# EAGLE design Data-logger_v01-02 (EAGLE 9.6.2)
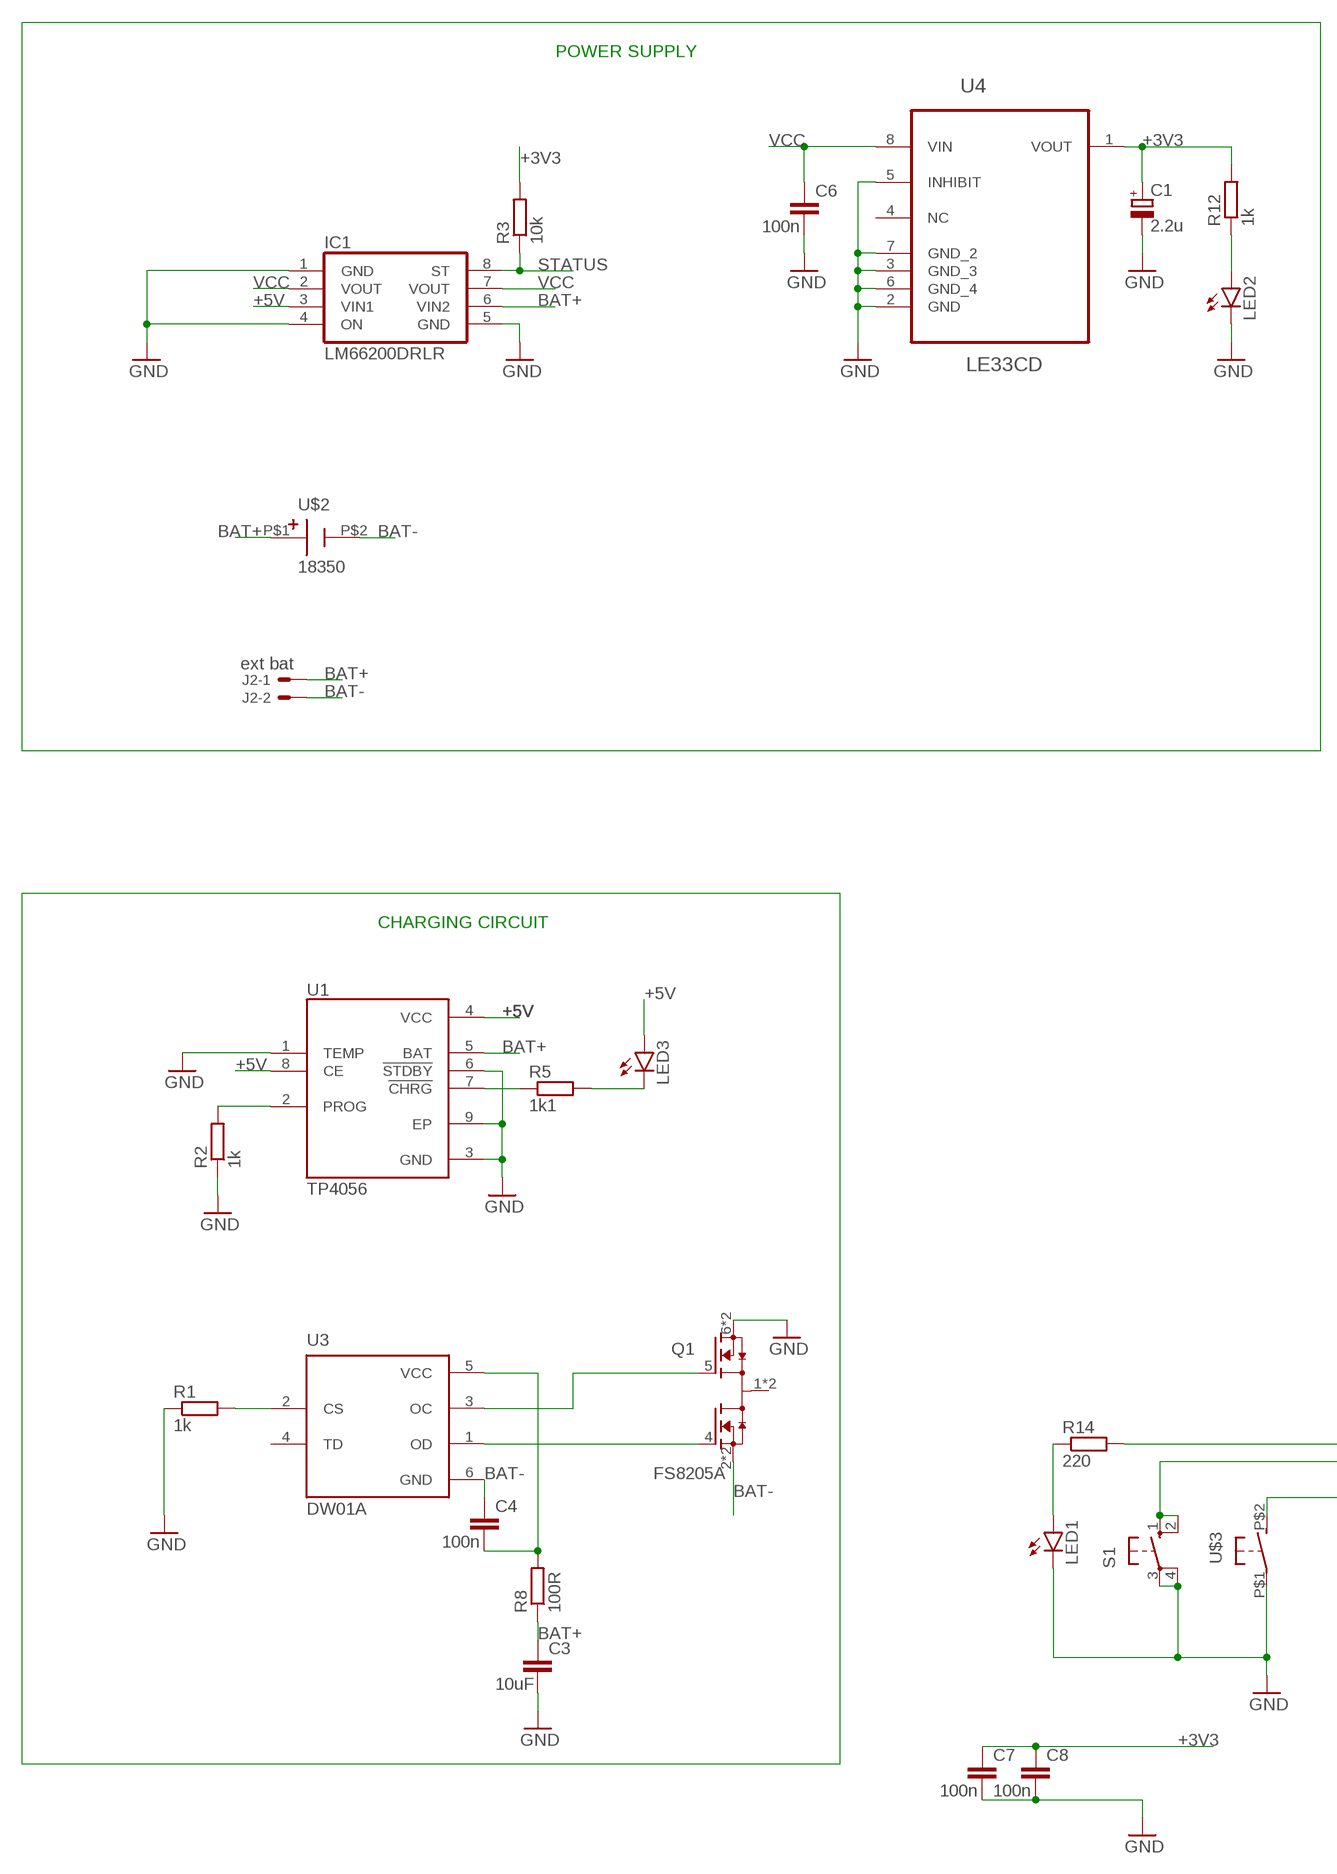
[diagram p0: schematic, sheet 1, part 1 of 2]
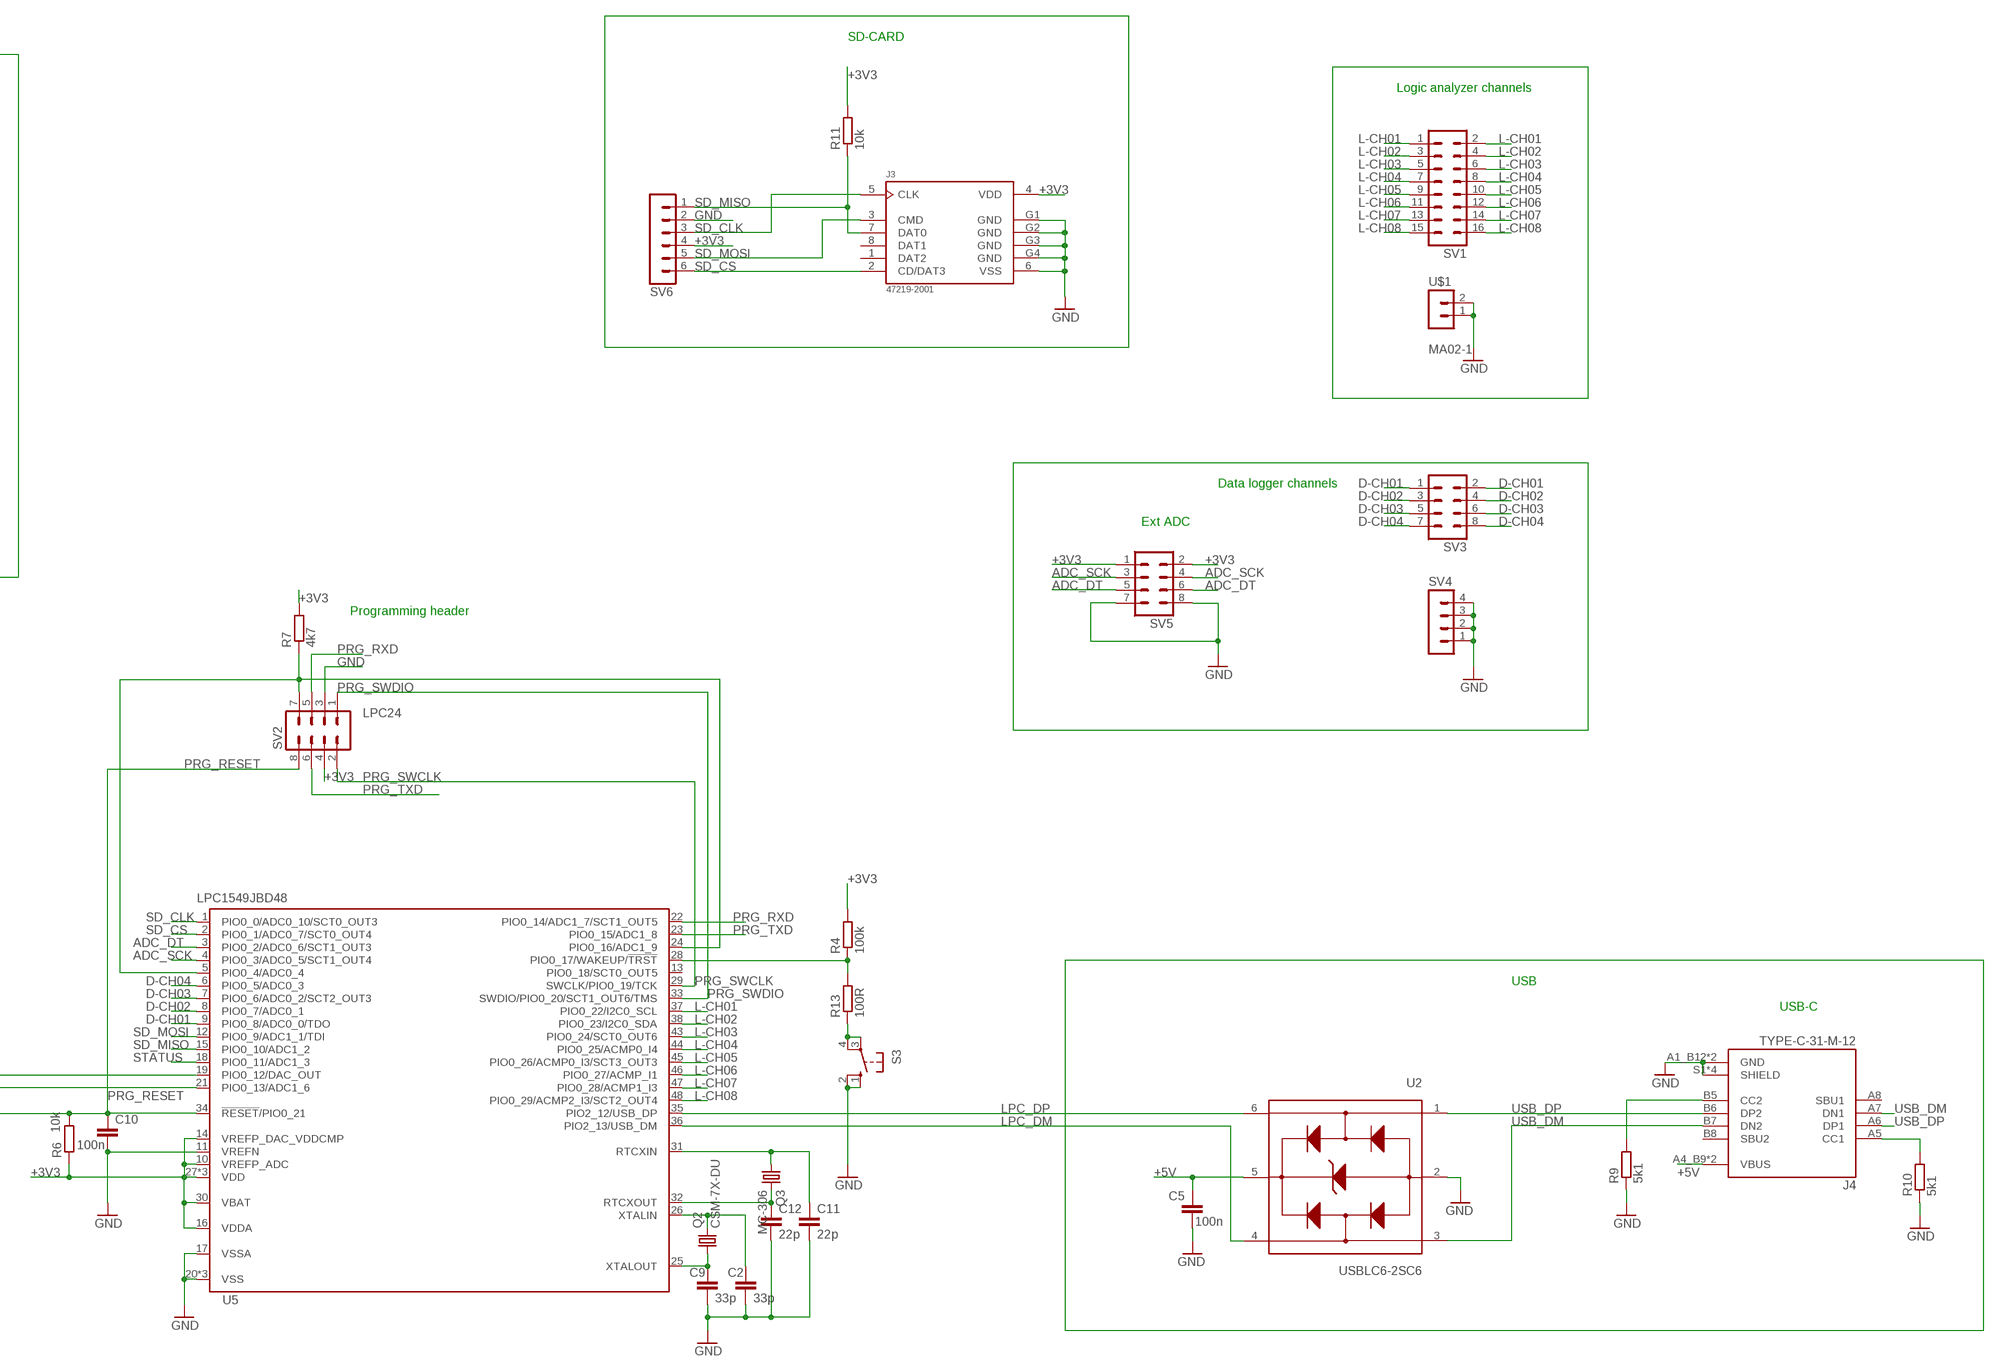
[diagram p1: schematic, sheet 1, part 2 of 2]

## Parts
C1  2.2u  CPOL-EU140CLH-0810  [140CLH-0810]
C2  33p  C-EUC0805  [C0805]
C3  10uF  C-EUC0805  [C0805]
C4  100n  C-EUC0805  [C0805]
C5  100n  C-EUC0805  [C0805]
C6  100n  C-EUC0805  [C0805]
C7  100n  C-EUC0805  [C0805]
C8  100n  C-EUC0805  [C0805]
C9  33p  C-EUC0805  [C0805]
C10  100n  C-EUC0805  [C0805]
C11  22p  C-EUC0805  [C0805]
C12  22p  C-EUC0805  [C0805]
IC1  LM66200DRLR  [SOT8]
J2  ext bat  22-05-7028-02  [7395-02]
J3  47219-2001  [MOLEX_47219-2001]
J4  TYPE-C-31-M-12  [HRO_TYPE-C-31-M-12]
LED1  LEDCHIPLED_1206  [CHIPLED_1206]
LED2  LEDCHIPLED_1206  [CHIPLED_1206]
LED3  LEDCHIPLED_1206  [CHIPLED_1206]
Q1  FS8205A  [SOP65P640X120-8N]
Q2  CSM-7X-DU  [CSM-7X-DU]
Q3  MC-306  [MC-306]
R1  1k  R-EU_R0805  [R0805]
R2  1k  R-EU_R0805  [R0805]
R3  10k  R-EU_R0805  [R0805]
R4  100k  R-EU_R0805  [R0805]
R5  1k1  R-EU_R0805  [R0805]
R6  10k  R-EU_R0805  [R0805]
R7  4k7  R-EU_R0805  [R0805]
R8  100R  R-EU_R0805  [R0805]
R9  5k1  R-EU_R0805  [R0805]
R10  5k1  R-EU_R0805  [R0805]
R11  10k  R-EU_R0805  [R0805]
R12  1k  R-EU_R0805  [R0805]
R13  100R  R-EU_R0805  [R0805]
R14  220  R-EU_R0805  [R0805]
S1  10-XX  [B3F-10XX]
S3  10-XX  [B3F-10XX]
SV1  MA08-2  [MA08-2]
SV2  MA04-2  [MA04-2]
SV3  MA04-2  [MA04-2]
SV4  MA04-1  [MA04-1]
SV5  MA04-2  [MA04-2]
SV6  MA06-1  [MA06-1]
U1  TP4056  [SOP127P600X175-9N]
U2  USBLC6-2SC6  [SOT95P280X145-6N]
U3  DW01A  [SOT95P280X145-6N]
U4  LE33CD  [SOIC127P600X175-8N]
U5  LPC1549JBD48  [SOT313-2]
U$1  MA02-1  [MA02-1]
U$2  18350  [18350]
U$3  BUTTON_SMD_MINI  [PTS636SP43SMTRLFS]

## Nets
+3V3: C1.+ C7.1 C8.1 J3.4(VDD) R3.2 R4.2 R6.1 R7.2 R11.2 R12.2 SV2.4 SV5.1 SV5.2 SV6.4 U4.1(VOUT) U5.10(VREFP_ADC) U5.14(VREFP_DAC_VDDCMP) U5.16(VDDA) U5.27(VDD) U5.30(VBAT) U5.39(VDD) U5.42(VDD)
+5V: C5.1 IC1.3(VIN1) J4.A4_B9(VBUS) J4.B4_A9(VBUS) LED3.A U1.4(VCC) U1.8(CE) U2.5(VBUS)
ADC_DT: SV5.5 SV5.6 U5.3(PIO0_2/ADC0_6/SCT1_OUT3)
ADC_SCK: SV5.3 SV5.4 U5.4(PIO0_3/ADC0_5/SCT1_OUT4)
BAT+: C3.1 IC1.6(VIN2) J2.1 R8.1 U1.5(BAT) U$2.P$1(+)
BAT-: C4.1 J2.2 Q1.2(S1) Q1.3(S1) U3.6(GND) U$2.P$2(-)
D-CH01: SV3.1 SV3.2 U5.9(PIO0_8/ADC0_0/TDO)
D-CH02: SV3.3 SV3.4 U5.8(PIO0_7/ADC0_1)
D-CH03: SV3.5 SV3.6 U5.7(PIO0_6/ADC0_2/SCT2_OUT3)
D-CH04: SV3.7 SV3.8 U5.6(PIO0_5/ADC0_3)
GND: C1.- C2.2 C3.2 C5.2 C6.2 C7.2 C8.2 C9.2 C10.2 C11.2 C12.2 IC1.1(GND) IC1.4(ON) IC1.5(GND) J3.6(VSS) J3.G1(GND) J3.G2(GND) J3.G3(GND) J3.G4(GND) J4.A1_B12(GND) J4.B1_A12(GND) J4.S1(SHIELD) J4.S2(SHIELD) J4.S3(SHIELD) J4.S4(SHIELD) LED1.C LED2.C Q1.6(S2) Q1.7(S2) R1.1 R2.1 R9.1 R10.1 S1.3(P) S1.4(P1) S3.1(S) S3.2(S1) SV2.3 SV4.1 SV4.2 SV4.3 SV4.4 SV5.7 SV5.8 SV6.2 U1.1(TEMP) U1.3(GND) U1.6(!STDBY) U1.9(EP) U2.2(GND) U4.2(GND) U4.3(GND_3) U4.5(INHIBIT) U4.6(GND_4) U4.7(GND_2) U5.11(VREFN) U5.17(VSSA) U5.20(VSS) U5.40(VSS) U5.41(VSS) U$1.1 U$1.2 U$3.P$1(P)
L-CH01: SV1.1 SV1.2 U5.37(PIO0_22/I2C0_SCL)
L-CH02: SV1.3 SV1.4 U5.38(PIO0_23/I2C0_SDA)
L-CH03: SV1.5 SV1.6 U5.43(PIO0_24/SCT0_OUT6)
L-CH04: SV1.7 SV1.8 U5.44(PIO0_25/ACMP0_I4)
L-CH05: SV1.9 SV1.10 U5.45(PIO0_26/ACMP0_I3/SCT3_OUT3)
L-CH06: SV1.11 SV1.12 U5.46(PIO0_27/ACMP_I1)
L-CH07: SV1.13 SV1.14 U5.47(PIO0_28/ACMP1_I3)
L-CH08: SV1.15 SV1.16 U5.48(PIO0_29/ACMP2_I3/SCT2_OUT4)
LPC24: R7.1 SV2.7 U5.5(PIO0_4/ADC0_4) U5.24(PIO0_16/ADC1_9)
LPC25: C9.1 Q2.1 U5.25(XTALOUT)
LPC26: C2.1 Q2.2 U5.26(XTALIN)
LPC31: C11.1 Q3.1 U5.31(RTCXIN)
LPC32: C12.1 Q3.4 U5.32(RTCXOUT)
LPC_DM: U2.4(I/O2_OUT) U5.36(PIO2_13/USB_DM)
LPC_DP: U2.6(I/O1_OUT) U5.35(PIO2_12/USB_DP)
N$1: R2.2 U1.2(PROG)
N$2: C4.2 R8.2 U3.5(VCC)
N$3: R1.2 U3.2(CS)
N$4: Q1.4(G1) U3.1(OD)
N$5: Q1.5(G2) U3.3(OC)
N$6: R5.1 U1.7(!CHRG)
N$7: J4.A5(CC1) R10.2
N$8: LED3.C R5.2
N$13: R4.1 R13.2 U5.28(PIO0_17/WAKEUP/!TRST)
N$14: R13.1 S3.3(P) S3.4(P1)
N$15: J4.B5(CC2) R9.2
N$16: S1.1(S) S1.2(S1) U5.21(PIO0_13/ADC1_6)
N$19: LED2.A R12.1
N$20: LED1.A R14.1
N$21: R14.2 U5.19(PIO0_12/DAC_OUT)
PRG_RESET: C10.1 R6.2 SV2.8 U5.34(!RESET!/PIO0_21) U$3.P$2(S)
PRG_RXD: SV2.5 U5.22(PIO0_14/ADC1_7/SCT1_OUT5)
PRG_SWCLK: SV2.2 U5.29(SWCLK/PIO0_19/TCK)
PRG_SWDIO: SV2.1 U5.33(SWDIO/PIO0_20/SCT1_OUT6/TMS)
PRG_TXD: SV2.6 U5.23(PIO0_15/ADC1_8)
SD_CLK: J3.5(CLK) SV6.3 U5.1(PIO0_0/ADC0_10/SCT0_OUT3)
SD_CS: J3.2(CD/DAT3) SV6.6 U5.2(PIO0_1/ADC0_7/SCT0_OUT4)
SD_MISO: J3.7(DAT0) R11.1 SV6.1 U5.15(PIO0_10/ADC1_2)
SD_MOSI: J3.3(CMD) SV6.5 U5.12(PIO0_9/ADC1_1/TDI)
STATUS: IC1.8(ST) R3.1 U5.18(PIO0_11/ADC1_3)
USB_DM: J4.A7(DN1) J4.B7(DN2) U2.3(I/O2_IN)
USB_DP: J4.A6(DP1) J4.B6(DP2) U2.1(I/O1_IN)
VCC: C6.1 IC1.2(VOUT) IC1.7(VOUT) U4.8(VIN)
Unconnected: J3.1(DAT2) J3.8(DAT1) J4.A8(SBU1) J4.B8(SBU2) Q1.1(D12) Q1.8(D12) U3.4(TD) U4.4(NC) U5.13(PIO0_18/SCT0_OUT5)

## Notes on the sheet
- SD-CARD
- POWER SUPPLY
- Logic analyzer channels
- Data logger channels
- Ext ADC
- Programming header
- CHARGING CIRCUIT
- USB
- USB-C

## Library data of the parts
C1 = rcl:CPOL-EU: POLARIZED CAPACITOR, European symbol; SPICEPREFIX: C
C2-C12 = rcl:C-EU: CAPACITOR, European symbol; SPICEPREFIX: C
IC1 = LM66200DRLR:LM66200DRLR: Check availability <https://pricing.snapeda.com/parts/LM66200DRLR/Texas%20Instruments/view-part?ref=eda>; AVAILABILITY: In Stock; CHECK_PRICES: https://www.snapeda.com/parts/LM66200DRLR/Texas+Instruments/view-part/?ref=eda; DESCRIPTION: 1.6-V to 5.5-V, 40-mΩ, 2.5-A, low-IQ, dual ideal diode; MF: Texas Instruments; MP: LM66200DRLR; PACKAGE: None; PRICE: None; SNAPEDA_LINK: https://www.snapeda.com/parts/LM66200DRLR/Texas+Instruments/view-part/?ref=snap
J2 = con-molex:22-?-02: CONNECTOR wire to board 2.54 mm (.1 inch) pitch header; MF: MOLEX; OC_FARNELL: 9731601; OC_NEWARK: unknown
J3 = micro-sd-47219-2001:47219-2001: Check availability <https://pricing.snapeda.com/parts/472192001/Molex/view-part?ref=eda>; AVAILABILITY: In Stock; CHECK_PRICES: https://www.snapeda.com/parts/472192001/Molex/view-part/?ref=eda; DESCRIPTION: 8 Position Card Connector Secure Digital - microSD™ Surface Mount, Right Angle Gold; MF: Molex; MP: 472192001; PACKAGE: None; PRICE: None; SNAPEDA_LINK: https://www.snapeda.com/parts/472192001/Molex/view-part/?ref=snap
J4 = TYPE-C-31-M-12:TYPE-C-31-M-12: Check availability <https://pricing.snapeda.com/parts/TYPE-C-31-M-12/HRO%20Electronics%20Co.%2C%20Ltd./view-part?ref=eda>; AVAILABILITY: Not in stock; CHECK_PRICES: https://www.snapeda.com/parts/TYPE-C-31-M-12/HRO+Electronics+Co.%252C+Ltd./view-part/?ref=eda; DESCRIPTION: USB Connectors 24 Receptacle 1 8.94*7.3mm RoHS; MF: HRO Electronics Co., Ltd.; MP: TYPE-C-31-M-12; PACKAGE: Package; PRICE: None; SNAPEDA_LINK: https://www.snapeda.com/parts/TYPE-C-31-M-12/HRO+Electronics+Co.%252C+Ltd./view-part/?ref=snap
LED1-LED3 = led:LED: LED OSRAM: - CHIPLED LG R971, LG N971, LY N971, LG Q971, LY Q971, LO R971, LY R971 LH N974, LH R974 LS Q976, LO Q976, LY Q976 LO Q996 - Hyper CHIPLED LW Q18S LB Q993, LB Q99A, LB R99A - SideLED LS A670, LO A670, LY A670, LG A670, LP A670 LB A673, LV A673, LT A673, LW A673 LH A674 LY A675 LS A676, LA A676, LO A676, LY A676, LW A676 LS A679, LY A679, LG A679 - Hyper Micro SIDELED® LS Y876, LA Y876, LO Y876, LY Y876 LT Y87S - SmartLED LW L88C, LW L88S LB L89C, LB L89S, LG L890 LS L89K, LO L89K, LY L89K LS L896, LA L896, LO L896, LY L896 - TOPLED LS T670, LO T670, LY T670, LG T670, LP T670 LSG T670, LSP T670, LSY T670, LOP T670, LYG T670 LG T671, LOG T671, LSG T671 LB T673, LV T673, LT T673, LW T673 LH T674 LS T676, LA T676, LO T676, LY T676, LB T676, LH T676, LSB T676, LW T676 LB T67C, LV T67C, LT T67C, LS T67K, LO T67K, LY T67K, LW E67C LS E67B, LA E67B, LO E67B, LY E67B, LB E67C, LV E67C, LT E67C LW T67C LS T679, LY T679, LG T679 LS T770, LO T770, LY T770, LG T770, LP T770 LB T773, LV T773, LT T773, LW T773 LH T774 LS E675, LA E675, LY E675, LS T675 LS T776, LA T776, LO T776, LY T776, LB T776 LHGB T686 LT T68C, LB T68C - Hyper Mini TOPLED® LB M676 - Mini TOPLED Santana® LG M470 LS M47K, LO M47K, LY M47K Source: http://www.osram.convergy.de LUXEON: - LUMILED® LXK2-PW12-R00, LXK2-PW12-S00, LXK2-PW14-U00, LXK2-PW14-V00 LXK2-PM12-R00, LXK2-PM12-S00, LXK2-PM14-U00 LXK2-PE12-Q00, LXK2-PE12-R00, LXK2-PE12-S00, LXK2-PE14-T00, LXK2-PE14-U00 LXK2-PB12-K00, LXK2-PB12-L00, LXK2-PB12-M00, LXK2-PB14-N00, LXK2-PB14-P00, LXK2-PB14-Q00 LXK2-PR12-L00, LXK2-PR12-M00, LXK2-PR14-Q00, LXK2-PR14-R00 LXK2-PD12-Q00, LXK2-PD12-R00, LXK2-PD12-S00 LXK2-PH12-R00, LXK2-PH12-S00 LXK2-PL12-P00, LXK2-PL12-Q00, LXK2-PL12-R00 Source: www.luxeon.com KINGBRIGHT: KA-3528ASYC Source: www.kingbright.com
Q1 = FS8205A_TSSOP-8:FS8205A: Check availability <https://pricing.snapeda.com/parts/FS8205A/Fortune%20Semiconductor/view-part?ref=eda>; AVAILABILITY: In Stock; CHECK_PRICES: https://www.snapeda.com/parts/FS8205A/Fortune+Semiconductor/view-part/?ref=eda; MF: Fortune Semiconductor; MP: FS8205A; PACKAGE: Package; PRICE: None; SNAPEDA_LINK: https://www.snapeda.com/parts/FS8205A/Fortune+Semiconductor/view-part/?ref=snap
Q2 = crystal:CSM-7X-DU: SMD CRYSTAL Source: www.ecsxtal.com .. Crystal 3.6864MHz CSM_7X_DU.PDF; OC_FARNELL: unknown; OC_NEWARK: unknown
Q3 = crystal:MC-306: kHz RANGE CRYSTAL UNIT SMD Source: MC-306_405_406_E07X.PDF Homepage <http://www.epsontoyocom.co.jp>; MPN: MC-306 60.0KHZ 100PPM ,12.5PF; OC_FARNELL: 1278040; OC_NEWARK: 31M5576
R1-R14 = rcl:R-EU_: RESISTOR, European symbol; SPICEPREFIX: R
S1 S3 = switch-omron:10-XX: OMRON SWITCH; MPN: B3F-1000; OC_FARNELL: 176432; OC_NEWARK: 36M3542
SV1 = 6x2-pin-header-2_54:MA08-2: PIN HEADER; OC_FARNELL: unknown; OC_NEWARK: unknown
SV2 SV3 SV5 = 6x2-pin-header-2_54:MA04-2: PIN HEADER; OC_FARNELL: unknown; OC_NEWARK: unknown
SV4 = 6x2-pin-header-2_54:MA04-1: PIN HEADER; OC_FARNELL: unknown; OC_NEWARK: unknown
SV6 = 6x2-pin-header-2_54:MA06-1: PIN HEADER; OC_FARNELL: unknown; OC_NEWARK: unknown
U1 = TP4056_SOP-8:TP4056: Check availability <https://pricing.snapeda.com/parts/TP4056/NanJing%20Top%20Power%20ASIC%20Corp./view-part?ref=eda>; AVAILABILITY: Not in stock; CHECK_PRICES: https://www.snapeda.com/parts/TP4056/NanJing+Top+Power+ASIC+Corp./view-part/?ref=eda; DESCRIPTION: Complete single cell Li-Ion battery with a constant current / constant voltage linear charger; MF: NanJing Top Power ASIC Corp.; MP: TP4056; PACKAGE: Package; PRICE: None; SNAPEDA_LINK: https://www.snapeda.com/parts/TP4056/NanJing+Top+Power+ASIC+Corp./view-part/?ref=snap
U2 = USBLC6-2SC6:USBLC6-2SC6: Check availability <https://pricing.snapeda.com/parts/USBLC6-2SC6/STMicroelectronics/view-part?ref=eda>; AVAILABILITY: In Stock; CHECK_PRICES: https://www.snapeda.com/parts/USBLC6-2SC6/STMicroelectronics/view-part/?ref=eda; DESCRIPTION: 17V Clamp 5A (8/20µs) Ipp Tvs Diode Surface Mount SOT-23-6; MF: STMicroelectronics; MP: USBLC6-2SC6; PACKAGE: SOT-23-6 STMicroelectronics; PRICE: None; SNAPEDA_LINK: https://www.snapeda.com/parts/USBLC6-2SC6/STMicroelectronics/view-part/?ref=snap
U3 = DW01A_SOT-23-6:DW01A: Check availability <https://pricing.snapeda.com/parts/DW01A/Fortune%20Semiconductor/view-part?ref=eda>; AVAILABILITY: Not in stock; CHECK_PRICES: https://www.snapeda.com/parts/DW01A/Fortune+Semiconductor/view-part/?ref=eda; DESCRIPTION: One Cell Lithium-ion/Polymer Battery Protection IC; MF: Fortune Semiconductor; MP: DW01A; PACKAGE: SOT-23-6 Fortune Semiconductor; PRICE: None; SNAPEDA_LINK: https://www.snapeda.com/parts/DW01A/Fortune+Semiconductor/view-part/?ref=snap
U4 = LE33CD_SOIC-8:LE33CD: Check availability <https://pricing.snapeda.com/parts/LE33CD/STMicroelectronics/view-part?ref=eda>; AVAILABILITY: In Stock; CHECK_PRICES: https://www.snapeda.com/parts/LE33CD/STMicroelectronics/view-part/?ref=eda; DESCRIPTION: Linear Voltage Regulator IC Positive Fixed 1 Output 100mA 8-SOIC; MF: STMicroelectronics; MP: LE33CD; PACKAGE: SOIC-8 STMicroelectronics; PRICE: None; SNAPEDA_LINK: https://www.snapeda.com/parts/LE33CD/STMicroelectronics/view-part/?ref=snap
U5 = LPC1549JBD48:LPC1549JBD48: Check availability <https://pricing.snapeda.com/parts/LPC1549JBD48/NXP%20Semiconductors/view-part?ref=eda>; AVAILABILITY: In Stock; CHECK_PRICES: https://www.snapeda.com/parts/LPC1549JBD48/NXP+Semiconductors/view-part/?ref=eda; DESCRIPTION: ARM® Cortex®-M3 LPC15xx Microcontroller IC 32-Bit 72MHz 256KB (256K x 8) FLASH 48-LQFP (7x7); MF: NXP Semiconductors; MP: LPC1549JBD48; PACKAGE: QFP-48 NXP; PRICE: None; SNAPEDA_LINK: https://www.snapeda.com/parts/LPC1549JBD48/NXP+Semiconductors/view-part/?ref=snap
U$1 = 6x2-pin-header-2_54:MA02-1
U$2 = BH-18650-PC:18350
U$3 = PTS636SP43SMTRLFS_button:BUTTON_SMD_MINI

## Board
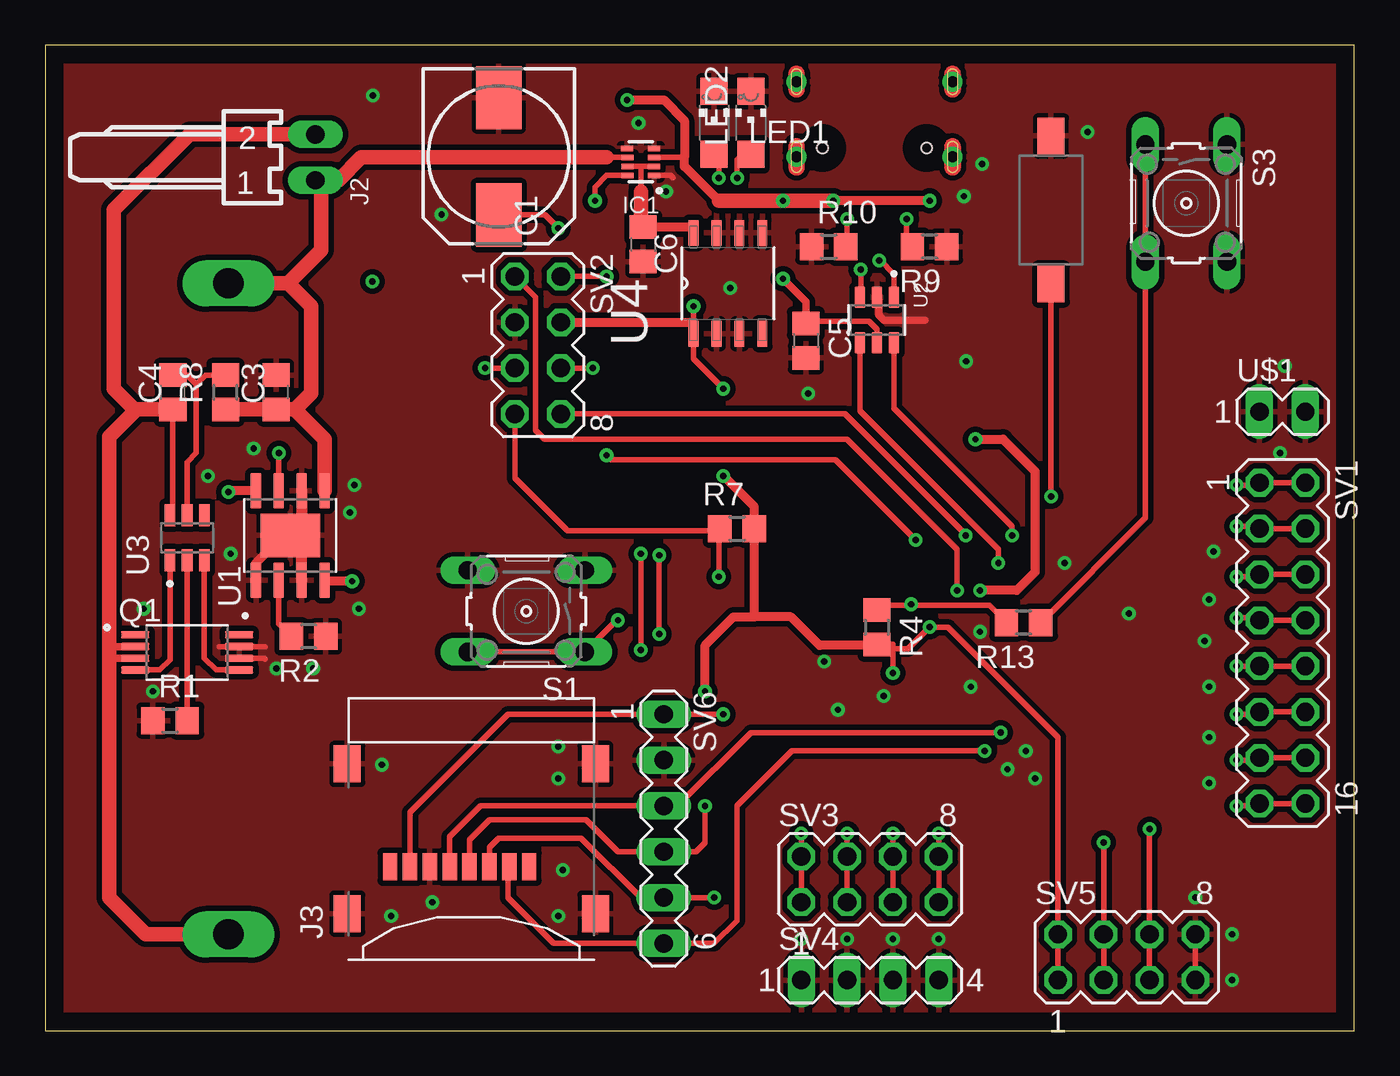
[diagram p2: board, top side]
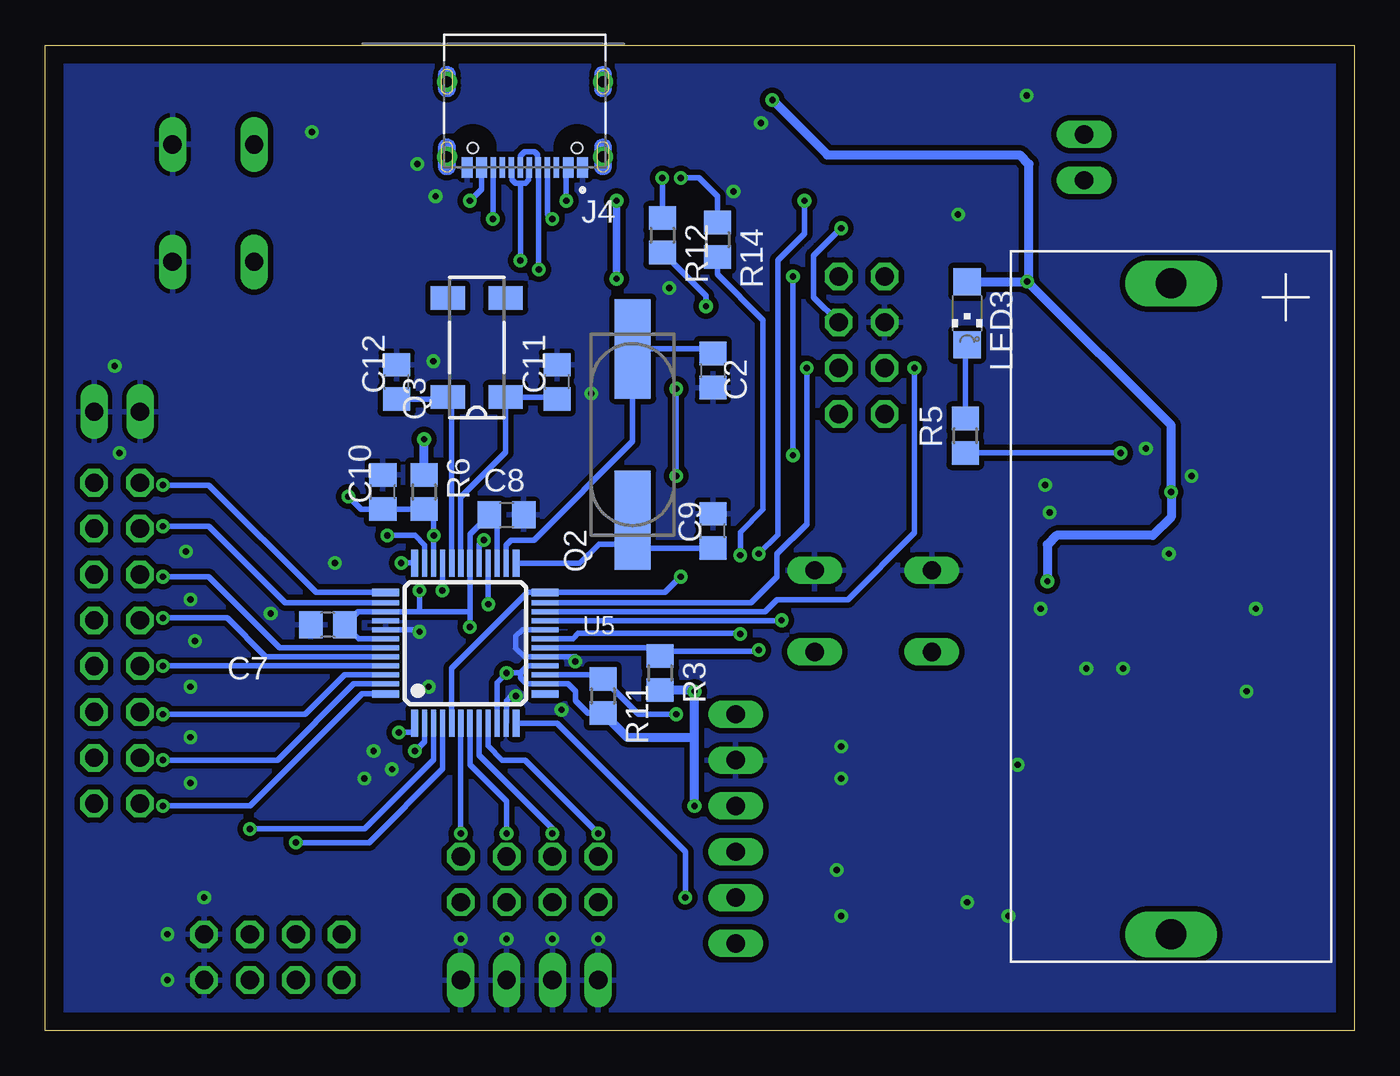
[diagram p3: board, bottom side, seen from below]

Size 72.57 x 54.6 mm. Coordinates in mm from the lower left corner, seen from the top.
Outline: 0,0 72.57,0 72.57,54.6 0,54.6 0,0
Copper layers (1*16): Top 0.035mm / dielectric 1.5mm / Bottom 0.035mm
Design rules "default": minimum track width 6mil, minimum drill 0.35mm, track to track 6mil, track to pad 6mil, pad to pad 6mil, via to via 6mil, smd to smd 6mil, copper to edge 40mil, drill to drill 6mil, minimum pad ring 10mil, minimum via ring 8mil, stop-mask expansion 4mil, vias tented up to drill 0mil, thermal gap 10mil

### Footprints (pad centres in the part's own frame; a part is rotated, then mirrored left to right if it is on the bottom)
140CLH-0810 = smd 3.5 x 2.5: + 3.25,0; - -3.25,0
C0805 = smd 1.3 x 1.5: 1 -0.95,0; 2 0.95,0
SOT8 = smd 0.3 x 0.67: 1 -0.75,-0.74; 2 -0.25,-0.74; 3 0.25,-0.74; 4 0.75,-0.74; 5 0.75,0.76; 6 0.25,0.74; 7 -0.25,0.74; 8 -0.75,0.74
7395-02 = drill 1.016 long: 1 1.27,0; 2 -1.27,0
MOLEX_47219-2001 = smd 0.8 x 1.5: 1 3.2,-2.1; 2 2.1,-2.1; 3 1,-2.1; 4 -0.1,-2.1; 5 -1.2,-2.1; 6 -2.3,-2.1; 7 -3.4,-2.1; 8 -4.5,-2.1 | smd 1.5 x 2.05: G1 6.875,-4.7; G2 6.875,3.6; G3 -6.875,3.6; G4 -6.875,-4.7
HRO_TYPE-C-31-M-12 = smd 0.6 x 1.14: A1_B12 -3.2,4.75; A4_B9 -2.4,4.75; B1_A12 3.2,4.75; B4_A9 2.4,4.75 | smd 0.3 x 1.14: A5 -1.25,4.75; A6 -0.25,4.75; A7 0.25,4.75; A8 1.25,4.75; B5 1.75,4.75; B6 0.75,4.75; B7 -0.75,4.75; B8 -1.75,4.75 | drill 0.6 pad 0.9: S1 -4.325,4.17; S2 4.325,4.17; S3 -4.325,0; S4 4.325,0 | hole 0.6: -2.89,3.68; 2.89,3.68
CHIPLED_1206 = smd 1.5 x 1.5: A 0,-1.75; C 0,1.75
SOP65P640X120-8N = smd 1.56 x 0.4: 1 -2.88,0.975; 2 -2.88,0.325; 3 -2.88,-0.325; 4 -2.88,-0.975; 5 2.88,-0.975; 6 2.88,-0.325; 7 2.88,0.325; 8 2.88,0.975
CSM-7X-DU = smd 5.5 x 2: 1 -4.75,0; 2 4.75,0
MC-306 = smd 1.3 x 1.9: 1 -2.75,-1.6; 2 2.75,-1.6; 3 2.75,1.6; 4 -2.75,1.6
R0805 = smd 1.3 x 1.5: 1 -0.95,0; 2 0.95,0
B3F-10XX = drill 1.016 long: 1 -3.251,2.261; 2 3.251,2.261; 3 -3.251,-2.261; 4 3.251,-2.261
MA08-2 = drill 1.016 octagon: 1 -8.89,-1.27; 2 -8.89,1.27; 3 -6.35,-1.27; 4 -6.35,1.27; 5 -3.81,-1.27; 6 -3.81,1.27; 7 -1.27,-1.27; 8 -1.27,1.27; 9 1.27,-1.27; 10 1.27,1.27; 11 3.81,-1.27; 12 3.81,1.27; 13 6.35,-1.27; 14 6.35,1.27; 15 8.89,-1.27; 16 8.89,1.27
MA04-2 = drill 1.016 octagon: 1 -3.81,-1.27; 2 -3.81,1.27; 3 -1.27,-1.27; 4 -1.27,1.27; 5 1.27,-1.27; 6 1.27,1.27; 7 3.81,-1.27; 8 3.81,1.27
MA04-1 = drill 1.016 long: 1 -3.81,0; 2 -1.27,0; 3 1.27,0; 4 3.81,0
MA06-1 = drill 1.016 long: 1 -6.35,0; 2 -3.81,0; 3 -1.27,0; 4 1.27,0; 5 3.81,0; 6 6.35,0
SOP127P600X175-9N = smd 1.97 x 0.6: 1 -2.475,1.905; 2 -2.475,0.635; 3 -2.475,-0.635; 4 -2.475,-1.905; 5 2.475,-1.905; 6 2.475,-0.635; 7 2.475,0.635; 8 2.475,1.905 | smd 2.413 x 3.302: 9 0,0
SOT95P280X145-6N = smd 1.21 x 0.59: 1 -1.255,0.95; 2 -1.255,0; 3 -1.255,-0.95; 4 1.255,-0.95; 5 1.255,0; 6 1.255,0.95
SOIC127P600X175-8N = smd 1.422 x 0.533: 1 -2.794,1.905; 2 -2.794,0.635; 3 -2.794,-0.635; 4 -2.794,-1.905; 5 2.794,-1.905; 6 2.794,-0.635; 7 2.794,0.635; 8 2.794,1.905
SOT313-2 = smd 0.4 x 1.5: 1 -2.81,-4.425; 12 2.81,-4.425; 25 2.81,4.425; 36 -2.81,4.425 | smd 0.28 x 1.5: 2 -2.25,-4.425; 3 -1.75,-4.425; 4 -1.25,-4.425; 5 -0.75,-4.425; 6 -0.25,-4.425; 7 0.25,-4.425; 8 0.75,-4.425; 9 1.25,-4.425; 10 1.75,-4.425; 11 2.25,-4.425; 26 2.25,4.425; 27 1.75,4.425; 28 1.25,4.425; 29 0.75,4.425; 30 0.25,4.425; 31 -0.25,4.425; 32 -0.75,4.425; 33 -1.25,4.425; 34 -1.75,4.425; 35 -2.25,4.425 | smd 1.5 x 0.4: 13 4.425,-2.81; 24 4.425,2.81; 37 -4.425,2.81; 48 -4.425,-2.81 | smd 1.5 x 0.28: 14 4.425,-2.25; 15 4.425,-1.75; 16 4.425,-1.25; 17 4.425,-0.75; 18 4.425,-0.25; 19 4.425,0.25; 20 4.425,0.75; 21 4.425,1.25; 22 4.425,1.75; 23 4.425,2.25; 38 -4.425,2.25; 39 -4.425,1.75; 40 -4.425,1.25; 41 -4.425,0.75; 42 -4.425,0.25; 43 -4.425,-0.25; 44 -4.425,-0.75; 45 -4.425,-1.25; 46 -4.425,-1.75; 47 -4.425,-2.25
MA02-1 = drill 1.016 long: 1 -1.27,0; 2 1.27,0
18350 = drill 1.676 pad 2.54 long: P$1 -17.272,0; P$2 18.796,0
PTS636SP43SMTRLFS = smd 2 x 1.5: P$1 -4.1,0; P$2 4.1,0

### Placement (x,y rotation side)
C1  25.15,48.44 270 top
C2  35.56,36.58 270 bottom
C3  12.8,35.37 90 top
C4  7.08,35.37 90 top
C5  42.16,38.23 270 top
C6  33.15,43.56 270 top
C7  56.9,22.48 180 bottom
C8  46.99,28.57 0 bottom
C9  35.56,27.69 90 bottom
C10  53.85,29.84 90 bottom
C11  44.2,35.94 90 bottom
C12  53.09,35.94 90 bottom
IC1  33.02,48.13 90 top
J2  14.99,48.39 270 top
J3  23.62,11.18 0 top
J4  45.97,52.58 180 bottom
LED1  37.08,50.29 0 top
LED2  39.12,50.29 0 top
LED3  21.46,39.75 180 bottom
Q1  7.87,20.95 0 top
Q2  40.01,33.02 90 bottom
Q3  48.64,37.85 90 bottom
R1  6.92,17.17 0 top
R2  14.61,21.84 180 top
R3  38.48,19.81 270 bottom
R4  46.1,22.35 270 top
R5  21.56,32.96 90 bottom
R6  51.56,29.84 270 bottom
R7  38.35,27.81 0 top
R8  10.01,35.37 90 top
R9  49.02,43.43 180 top
R10  43.43,43.43 0 top
R11  41.66,18.54 270 bottom
R12  38.35,44.07 270 bottom
R13  54.23,22.61 180 top
R14  35.31,43.81 270 bottom
S1  26.67,23.24 180 top
S3  63.25,45.85 270 top
SV1  68.58,21.46 270 top
SV2  27.3,37.97 270 top
SV3  45.72,8.38 0 top
SV4  45.72,2.79 0 top
SV5  59.94,4.06 0 top
SV6  34.29,11.18 270 top
U1  13.59,27.43 90 top
U2  46.1,39.37 270 top
U3  7.87,27.3 90 top
U4  37.85,41.4 90 top
U5  49.28,21.46 0 bottom
U$1  68.58,34.29 0 top
U$2  10.16,24.13 270 bottom
U$3  55.75,45.47 270 top

### Tracks (layer width: path | path; a pad name or v marks a point on that pad's centre or on a via)
+3V3  (via drill 0.35, 0.35 pad 0.7)
  Top 0.305: J3.4 23.52,10.57 24.64,11.68 29.97,11.68 31.75,9.91 SV6.4 36.07,9.91 36.58,10.41 v36.58,12.45 | SV5.1 SV5.2 56.13,16.26 50.04,22.35 v49.02,22.35 47.82,21.15 46.99,21.15 | v46.99,19.81 46.99,21.15 | 46.99,21.15 46.99,21.4 R4.2 46.03,21.34 | 35.94,39.12 U4.1 | U4.1 35.94,37.21 v37.59,35.56 | U4.1 v35.94,40.13 | C1.+ 27.71,45.19 v28.45,44.45
  Top 0.508: SV2.4 35.81,39.24 35.94,39.12 | v51.56,32.77 53.09,32.77 54.86,30.99 54.86,25.4 53.85,24.38 v51.82,24.38 | 46.03,21.34 42.93,21.34 41.34,22.93 39.3,22.93 | v36.58,18.8 36.58,21.34 38.17,22.93 39.3,22.93 | 39.3,22.93 R7.2 39.3,29.02 v37.59,30.73
  Bottom 0.305: U5.27 47.53,28.16 C8.1 49.03,27.49 U5.30 49.03,23.24 | 49.03,23.24 v49.03,22.36 v49.02,22.35 | R11.2 42.48,17.59 43.18,18.29 43.18,18.8 43.6,19.21 U5.14 45.88,19.21 46.23,19.56 46.23,19.81 | U5.16 45.83,20.21 46.23,19.81 | 46.23,19.81 v46.99,19.81 47.53,19.28 U5.10 | U5.42 55.18,21.71 C7.1 55.21,23.21 U5.39 51.82,23.21 | 49.03,23.24 49.05,23.21 51.82,23.21 | SV2.4 29.97,40.64 29.97,42.93 v28.45,44.45 | R12.2 35.94,40.71 v35.94,40.13 | v51.82,24.38 51.82,23.21 | v37.59,35.56 v37.59,30.73
  Bottom 0.508: v36.58,18.8 36.64,18.86 | 36.64,18.86 36.58,18.86 36.58,16.26 | 36.64,18.86 R3.2 | v36.58,12.45 36.58,16.26 | R6.1 v51.56,32.77 | R11.2 40.32,16.26 36.58,16.26
+5V  (via drill 0.35)
  Top 0.305: U2.5 46.1,38.86 45.65,39.31 42.2,39.31 C5.1 | 10.16,29.91 v10.16,29.84 | 15.56,24.89 U1.4 | IC1.3 35.44,48.38
  Top 0.406: C5.1 42.16,40.39 v40.89,41.66
  Top 0.508: U1.8 10.16,29.91 | v17.02,24.89 15.56,24.89 | v32.26,51.56 34.29,51.56 35.44,50.41 35.44,48.38 35.44,47.88 37.34,45.97 | v49.02,45.97 v43.69,45.97
  Top 0.813: v43.69,45.97 v40.89,45.97 37.34,45.97
  Bottom 0.305: J4.A4_B9 43.69,47.71 v43.69,45.97 | J4.B4_A9 48.37,46.62 v49.02,45.97
  Bottom 0.406: v40.89,41.66 v40.89,45.97
  Bottom 0.508: v17.02,24.89 17.02,26.92 16.51,27.43 11.18,27.43 10.16,28.45 v10.16,29.84 10.16,33.53 18.03,41.4 18.03,41.6 | LED3.A v18.13,41.5 18.03,41.6 | 18.03,41.6 18.03,48.01 18.54,48.51 29.21,48.51 v32.26,51.56
ADC_DT  (via drill 0.35 pad 0.7)
  Top 0.305: SV5.5 SV5.6 v61.21,11.18
  Bottom 0.305: v61.21,11.18 54.86,11.18 51.03,15.01 U5.3
ADC_SCK  (via drill 0.35 pad 0.7)
  Top 0.305: SV5.3 SV5.4 v58.67,10.41
  Bottom 0.305: v58.67,10.41 54.61,10.41 50.53,14.5 U5.4
BAT+
  Top 0.305: C3.1 13.84,34.42 | 15.3,47.05 15.24,47.12 J2.1 | IC1.6 31.11,48.38
  Top 0.813: R8.1 C3.1 13.85,34.42 14.73,35.31 14.73,40.13 13.46,41.4 | 13.84,34.42 15.49,32.77 U1.5 | 15.3,47.05 15.3,43.24 13.46,41.4 | J2.1 16.26,47.12 17.52,48.38 31.11,48.38 | U$2.P$1 13.46,41.4
BAT-
  Top 0.305: C4.1 7.08,28.56 U3.6 | 4.95,34.42 5.08,34.42 | 3.61,21.28 3.56,21.34 | 3.61,20.63 3.56,20.57
  Top 0.406: Q1.2 3.61,21.28 | Q1.3 3.61,20.63
  Top 0.813: J2.2 8,49.66 3.81,45.47 3.81,35.56 4.95,34.42 | C4.1 5.08,34.42 3.56,32.9 3.56,21.34 3.56,20.57 3.56,7.37 5.59,5.33 U$2.P$2
D-CH01  (via drill 0.35 pad 0.7)
  Top 0.305: v41.91,10.92 SV3.2 SV3.1
  Bottom 0.305: v41.91,10.92 45.97,14.99 47.24,14.99 48.03,15.77 U5.9
D-CH02  (via drill 0.35 pad 0.7)
  Top 0.305: v44.45,10.92 SV3.4 SV3.3
  Bottom 0.305: U5.8 48.53,15.25 44.45,11.18 v44.45,10.92
D-CH03  (via drill 0.35 pad 0.7)
  Top 0.305: SV3.5 SV3.6 v46.99,10.92
  Bottom 0.305: U5.7 49.03,14.74 46.99,12.7 v46.99,10.92
D-CH04  (via drill 0.35 pad 0.7)
  Top 0.305: v49.53,10.92 SV3.8 SV3.7
  Bottom 0.305: U5.6 v49.53,10.92
GND  (via drill 0.35)
  Top 0.305: SV5.8 SV5.7 | Q1.6 12.14,20.63 12.19,20.57 | 12.19,21.28 Q1.7 9.65,21.28 | IC1.1 34.66,47.38 34.8,47.24
  Top 0.406: U2.2 46.23,40.5 46.23,39.62 46.48,39.37 48.77,39.37
  Top 0.508: 14.22,27.43 U1.9 13.21,27.43 11.68,25.91 U1.1
  Top 0.61: U1.6 14.22,27.43 U1.3
  Bottom 0.305: U5.11 46.99,17.07 46.99,18.29 46.74,18.54 v46.48,18.54 | v43.18,20.45 43.18,20.71 U5.17 44.86,20.7 46.01,20.7 46.48,21.18 46.48,21.84 46.11,22.21 U5.20 | U5.41 51.93,22.21 v51.82,22.1
  other vias: 51.31,19.05 28.45,13.97 28.45,15.75 28.45,6.35 28.7,8.89 51.05,37.08 60.07,23.11 64.77,26.54 43.94,17.78 53.34,14.48 54.36,15.49 54.86,13.97 64.52,16.26 64.52,13.72 64.52,19.05 64.26,21.59 64.52,23.88 56.52,25.91 68.71,36.83 68.45,32 57.78,49.78 51.94,48.01 50.93,46.23 37.97,41.15 42.29,35.31 21.97,45.21 18.16,51.82 32.89,50.29 10.29,26.42 11.56,32.26 9.02,30.73 16.89,28.7 17.14,30.23 17.4,23.37 12.83,20.07 14.86,20.07 5.97,18.8 5.46,23.37 21.46,7.11 19.18,6.35 18.67,14.73 49.53,5.08 46.99,5.08 44.45,5.08 41.91,5.08 63.75,7.37 65.79,5.33 65.79,2.79 34.42,46.48
  pour Top (isolate 0.305): 0.25,54.86 72.14,54.86 72.14,-0.76 -0.02,-0.76
  pour Bottom (isolate 0.305): 0,56.13 73.15,56.13 73.15,-1.52 0,-1.52
L-CH01  (via drill 0.35 pad 0.7)
  Top 0.305: v66.04,30.23 67.18,30.23 SV1.1 SV1.2
  Bottom 0.305: U5.37 57.55,24.27 63.5,30.23 v66.04,30.23
L-CH02  (via drill 0.35 pad 0.7)
  Top 0.305: v66.04,27.94 67.18,27.94 SV1.3 SV1.4
  Bottom 0.305: U5.38 59.27,23.71 63.5,27.94 v66.04,27.94
L-CH03  (via drill 0.35 pad 0.7)
  Top 0.305: v66.04,25.15 67.18,25.15 SV1.5 SV1.6
  Bottom 0.305: U5.43 59.57,21.21 63.5,25.15 v66.04,25.15
L-CH04  (via drill 0.35 pad 0.7)
  Top 0.305: v66.04,22.86 67.18,22.86 SV1.7 SV1.8
  Bottom 0.305: U5.44 60.34,20.71 62.48,22.86 v66.04,22.86
L-CH05  (via drill 0.35 pad 0.7)
  Top 0.305: v66.04,20.19 SV1.9 SV1.10
  Bottom 0.305: U5.45 66.04,20.21 v66.04,20.19
L-CH06  (via drill 0.35 pad 0.7)
  Top 0.305: v66.04,17.53 67.18,17.53 SV1.11 SV1.12
  Bottom 0.305: U5.46 55.98,19.71 58.17,17.53 v66.04,17.53
L-CH07  (via drill 0.35 pad 0.7)
  Top 0.305: v66.04,14.99 67.18,14.99 SV1.13 SV1.14
  Bottom 0.305: U5.47 55.46,19.21 59.69,14.99 v66.04,14.99
L-CH08  (via drill 0.35 pad 0.7)
  Top 0.305: v66.04,12.45 67.18,12.45 SV1.15 SV1.16
  Bottom 0.305: U5.48 55.01,18.65 61.21,12.45 v66.04,12.45
LPC24  (via drill 0.35)
  Top 0.305: SV2.7 26.04,30.61 28.96,27.69 37.4,27.69 R7.1 37.34,27.75 v37.34,25.15
  Bottom 0.305: U5.5 50.03,20.08 45.83,24.27 U5.24 38.21,24.27 v37.34,25.15
LPC25
  Bottom 0.305: Q2.1 40.01,27.12 39.84,26.96 | 39.84,26.96 39.62,26.74 C9.1 | U5.25 42.95,25.89 41.88,26.96 39.84,26.96
LPC26
  Bottom 0.305: C2.1 35.8,37.77 Q2.2 40.01,32.64 45.47,27.18 46.74,27.18 47.03,26.89 U5.26
LPC31
  Bottom 0.305: U5.31 49.53,29.56 47.04,32.05 Q3.1 44.3,35.1 C11.1
LPC32
  Bottom 0.305: U5.32 50.03,34.88 Q3.4 50.35,34.99 C12.1
LPC_DM  (via drill 0.35 pad 0.7)
  Top 0.305: v52.83,25.91 52.83,26.67 45.15,34.35 U2.4
  Bottom 0.305: U5.36 52.09,26.4 52.07,26.42 52.07,25.89 U5.36 | U5.36 52.11,25.91 v52.83,25.91
LPC_DP  (via drill 0.35 pad 0.7)
  Top 0.305: v53.59,27.43 53.59,27.94 47.05,34.48 U2.6
  Bottom 0.305: U5.35 51.53,26.89 52.07,27.43 v53.59,27.43
N$1
  Top 0.305: R2.2 12.95,22.54 U1.2
N$2
  Top 0.305: U3.5 7.87,31.5 8.38,32 8.38,35.81 | 8.38,35.81 7.87,36.32 C4.2 | 8.38,35.81 8.89,36.32 R8.2
N$3
  Top 0.305: R1.2 U3.2
N$4
  Top 0.305: U3.1 6.92,20.55 6.35,19.98 Q1.4
N$5
  Top 0.305: U3.3 8.82,20.64 9.48,19.98 Q1.5
N$6  (via drill 0.35)
  Top 0.305: v12.95,32 U1.7
  Bottom 0.305: R5.1 v12.96,32.01 v12.95,32
N$7  (via drill 0.35)
  Top 0.305: v44.45,44.96 44.45,43.5 R10.2
  Bottom 0.305: J4.A5 44.72,45.23 v44.45,44.96
N$8
  Bottom 0.305: LED3.C 21.56,37.9 R5.2
N$13  (via drill 0.35 pad 0.7)
  Top 0.305: 48.01,23.56 46.35,23.56 R4.1 | 48.01,23.56 52.33,23.56 R13.2 | v48.01,23.62 48.01,23.56
  Bottom 0.305: U5.28 48.03,23.64 v48.01,23.62
N$14
  Top 0.305: S3.3 S3.4 60.98,28.41 R13.1
N$15  (via drill 0.35)
  Top 0.305: R9.2 47.75,43.75 v47.75,44.96
  Bottom 0.305: J4.B5 47.75,47.8 v47.75,44.96
N$16  (via drill 0.35 pad 0.7)
  Top 0.305: v31.75,22.73 31.67,22.73 S1.1 S1.2
  Bottom 0.305: U5.21 31.75,22.71 v31.75,22.73
N$19  (via drill 0.35)
  Top 0.305: LED2.A 38.64,48.54 38.35,48.26 v38.35,47.24
  Bottom 0.305: v38.35,47.24 R12.1
N$20  (via drill 0.35)
  Top 0.305: LED1.A 37.34,48.54 v37.34,47.24
  Bottom 0.305: v37.34,47.24 36.32,47.24 35.31,46.23 R14.1
N$21  (via drill 0.35)
  Top 0.305: v34.04,21.97 v34.04,26.34
  Bottom 0.305: R14.2 35.31,41.91 32.77,39.37 32.77,28.88 34.04,27.61 v34.04,26.34 | U5.19 43.31,21.71 43.02,22 34.04,22 v34.04,21.97
PRG_RESET  (via drill 0.35)
  Top 0.305: SV2.8 44.32,34.16 51.05,27.43 v51.03,27.43 | U$3.P$2 v55.75,29.59
  Bottom 0.305: U5.34 v51.03,27.43 51.03,28.36 R6.2 C10.1 55.06,28.89 v55.75,29.59
PRG_RXD  (via drill 0.35 pad 0.7)
  Top 0.305: v24.38,36.7 SV2.5
  Bottom 0.305: U5.22 32.67,23.21 32,23.88 28.08,23.88 24.38,27.57 v24.38,36.7
PRG_SWCLK  (via drill 0.35)
  Top 0.305: SV2.2 v31.11,41.78 | v31.11,31.88 31.37,31.62 43.81,31.62 v48.26,27.18
  Bottom 0.305: v31.11,41.78 v31.11,31.88 | U5.29 48.51,25.9 48.51,26.92 v48.26,27.18
PRG_SWDIO  (via drill 0.35)
  Top 0.305: SV2.1 27.18,40.64 27.18,33.27 27.69,32.77 44.45,32.77 50.55,26.67 v50.55,24.38
  Bottom 0.305: v50.55,24.38 50.53,24.4 U5.33
PRG_TXD  (via drill 0.35 pad 0.7)
  Top 0.305: v30.35,36.7 SV2.6
  Bottom 0.305: U5.23 33.44,23.71 32,25.15 32,26.42 30.35,28.07 v30.35,36.7
SD_CLK  (via drill 0.35 pad 0.7)
  Top 0.305: J3.5 22.42,10.74 24.13,12.45 SV6.3 35.05,12.45 39.12,16.51 v52.96,16.51
  Bottom 0.305: U5.1 52.09,16.53 52.96,16.53 v52.96,16.51
SD_CS  (via drill 0.35 pad 0.7)
  Top 0.305: J3.2 25.65,9.01 25.65,7.37 28.19,4.83 SV6.6 37.08,4.83 38.35,6.1 38.35,12.45 41.4,15.49 v52.07,15.49
  Bottom 0.305: U5.2 51.53,16 52.05,15.48 v52.07,15.49
SD_MISO  (via drill 0.35 pad 0.7)
  Top 0.305: J3.7 20.22,12.09 25.65,17.53 SV6.1 v37.59,17.53
  Bottom 0.305: U5.15 42.42,19.71 41.88,19.71 R11.1 39.69,17.53 v37.59,17.53
SD_MOSI  (via drill 0.35 pad 0.7)
  Top 0.305: J3.3 24.62,10.14 25.15,10.67 29.72,10.67 33.02,7.37 SV6.5 v37.08,7.37
  Bottom 0.305: v37.08,7.37 37.08,9.91 44.2,17.02 46.45,17.02 U5.12
STATUS  (via drill 0.35)
  Top 0.305: v30.48,45.97 30.48,46.74 31.13,47.38 IC1.8 | v33.02,21.08 v33.02,26.42
  Bottom 0.305: v33.02,26.42 31.95,27.48 31.95,42.42 31.95,42.67 30.48,44.15 v30.48,45.97 | U5.18 38.93,21.21 R3.1 38.23,21.02 33.02,21.02 v33.02,21.08
USB_DM  (via drill 0.35 pad 0.7)
  Top 0.305: v45.21,42.16 45.21,40.69 U2.3
  Bottom 0.305: J4.A7 46.22,48.48 46,48.7 45.45,48.7 45.27,48.52 45.27,47.87 J4.B7 45.22,42.16 v45.21,42.16
USB_DP  (via drill 0.35 pad 0.7)
  Top 0.305: v46.23,42.67 46.26,42.7 47.05,41.91 U2.1
  Bottom 0.305: 46.23,46.95 46.5,46.95 46.68,47.13 46.68,47.78 J4.B6 | 46.23,46.95 45.95,46.95 45.77,47.13 45.77,47.78 J4.A6 | v46.23,42.67 46.23,46.95
VCC
  Top 0.305: U4.8 35.94,44.51 | IC1.2 33.02,47.88 | 33.02,47.88 IC1.7 | 33.02,46.48 33.02,47.88
  Top 0.508: 35.94,44.51 C6.1
  Top 0.813: C6.1 33.02,44.64 33.02,46.48

### Text on the board
blabel: External battery | RESET | WAKEUP | + | Charging | 1 | + | Logic analyzer / channels | GND | CH-08 | BUTTON | CH-07 | Li-ion / 18350 | CH-06 | CH-05 | CH-04 | MISO | CH-03 | GND | CH-02 | CLK | CH-01 | CH-02 | CH-03 | CH-04 | CH-01 | +3V3 | SD card | MOSI | +3V3 | SCK | DT | GND | CS | GND | Data logger | External ADC
tlabel: Hana Štěrbová | 256592 | VUT FEKT 2025 | Data-logger_v01-02